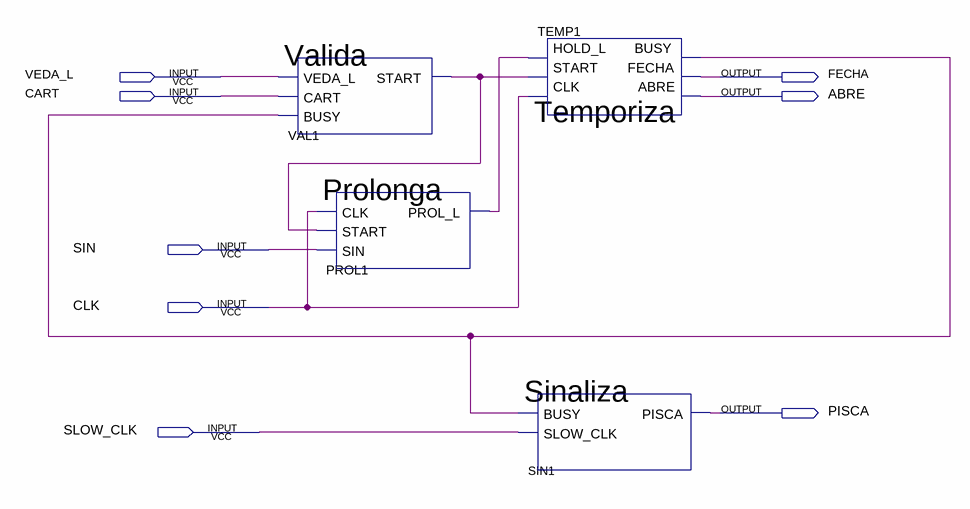
[diagram p0: schematic sheet]
// Quartus schematic Acesso.bdf as structural Verilog: 4 symbols, 8 pins
module Acesso (
  input  VEDA_L,
  input  CART,
  input  SIN,
  input  CLK,
  input  SLOW_CLK,
  output FECHA,
  output ABRE,
  output PISCA
);

  wire PROL1_prol_l, TEMP1_busy, VAL1_start;

  Valida VAL1 (.VEDA_L(VEDA_L), .CART(CART), .BUSY(TEMP1_busy), .START(VAL1_start));
  Prolonga PROL1 (.CLK(CLK), .START(VAL1_start), .SIN(SIN), .PROL_L(PROL1_prol_l));
  Temporiza TEMP1 (.CLK(CLK), .START(VAL1_start), .HOLD_L(PROL1_prol_l), .ABRE(ABRE), .FECHA(FECHA), .BUSY(TEMP1_busy));
  Sinaliza SIN1 (.BUSY(TEMP1_busy), .SLOW_CLK(SLOW_CLK), .PISCA(PISCA));
endmodule
